# Altium schematic sheet TOP.SchDoc
size A; SheetNumber: 1; SheetTotal: 2
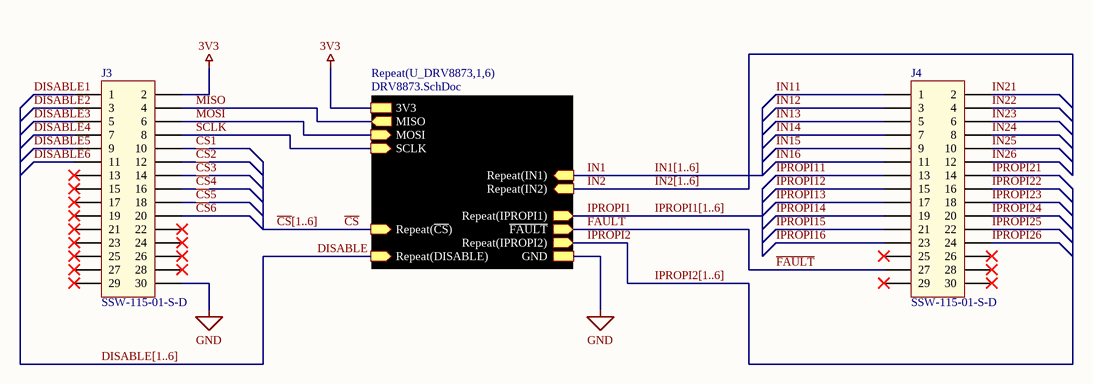
[diagram p0: TOP.SchDoc]

## Parts
J3  SSW-115-01-S-D  [SSW-115-01-S-D]
J4  SSW-115-01-S-D  [SSW-115-01-S-D]

## Sub-sheets
Repeat(U_DRV8873,1,6) = DRV8873.SchDoc: GND, 3V3, MISO (out), MOSI (in), SCLK (in), Repeat(~{CS}) (in), Repeat(IN1) (in), Repeat(IN2) (in), Repeat(DISABLE) (in), ~{FAULT} (out), Repeat(IPROPI1) (out), Repeat(IPROPI2) (out)

## Nets
3V3: J3.2 ; sheet Repeat(U_DRV8873,1,6)/3V3
GND: J3.30 ; sheet Repeat(U_DRV8873,1,6)/GND
~{CS}: sheet Repeat(U_DRV8873,1,6)/Repeat(~{CS})
~{CS}1: J3.10
~{CS}2: J3.12
~{CS}3: J3.14
~{CS}4: J3.16
~{CS}5: J3.18
~{CS}6: J3.20
DISABLE: sheet Repeat(U_DRV8873,1,6)/Repeat(DISABLE)
DISABLE1: J3.1
DISABLE2: J3.3
DISABLE3: J3.5
DISABLE4: J3.7
DISABLE5: J3.9
DISABLE6: J3.11
~{FAULT}: J4.27 ; sheet Repeat(U_DRV8873,1,6)/~{FAULT}
IN1: sheet Repeat(U_DRV8873,1,6)/Repeat(IN1)
IN2: sheet Repeat(U_DRV8873,1,6)/Repeat(IN2)
IN11: J4.1
IN12: J4.3
IN13: J4.5
IN14: J4.7
IN15: J4.9
IN16: J4.11
IN21: J4.2
IN22: J4.4
IN23: J4.6
IN24: J4.8
IN25: J4.10
IN26: J4.12
IPROPI1: sheet Repeat(U_DRV8873,1,6)/Repeat(IPROPI1)
IPROPI2: sheet Repeat(U_DRV8873,1,6)/Repeat(IPROPI2)
IPROPI11: J4.13
IPROPI12: J4.15
IPROPI13: J4.17
IPROPI14: J4.19
IPROPI15: J4.21
IPROPI16: J4.23
IPROPI21: J4.14
IPROPI22: J4.16
IPROPI23: J4.18
IPROPI24: J4.20
IPROPI25: J4.22
IPROPI26: J4.24
MISO: J3.4 ; sheet Repeat(U_DRV8873,1,6)/MISO
MOSI: J3.6 ; sheet Repeat(U_DRV8873,1,6)/MOSI
SCLK: J3.8 ; sheet Repeat(U_DRV8873,1,6)/SCLK

Not connected (* = marked no-connect by the designer): J3 13* 15* 17* 19* 21* 22* 23* 24* 25* 26* 27* 28* 29*; J4 25* 26* 28* 29* 30*

## Buses and harness runs
bus DISABLE[1..6]
bus IN1[1..6]
bus IN2[1..6]
bus IPROPI1[1..6]
bus IPROPI2[1..6]
bus ~{CS}[1..6]

## Library data of the parts
J3 J4 = CMPL-001-B539-A.1: CONN RCPT 30POS 0.1 GOLD PCB; Manufacturer: Samtec Inc.; Pitch: 0.100" (2.54mm); Number of Positions: 30; Number of Positions Loaded: All; Connector Type: Receptacle; Color: Black; Mounting Type: Through Hole; RoHS Compliance: Yes; Manufacturer Part Number: SSW-115-01-S-D; Supplier 1 Part Number: SAM1210-15-ND; Contact Finish Thickness: 30.0µin (0.76µm); Number of Rows: 2; Termination: Solder; Supplier 1: Digikey; Contact Finish: Gold; Row Spacing: -; Contact Type: Forked